# Altium schematic sheet Rpi.SchDoc
size A
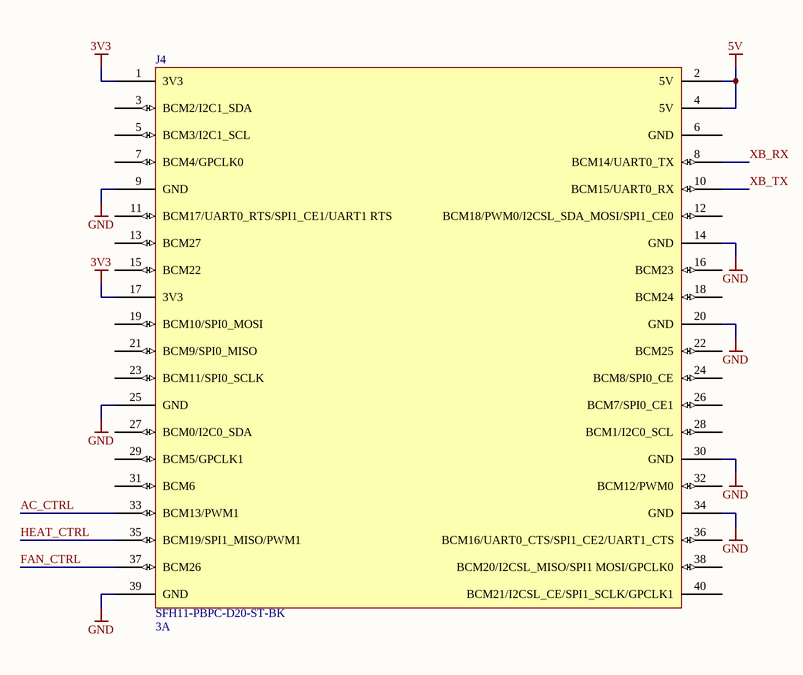
[diagram p0: Rpi.SchDoc]

## Parts
J4  Rating: 3A  [SFH11-PBPC-D20-ST-BK]  (hidden comment: J_RPI2B_ SFH11-PBPC-D20-ST-BK)

## Nets
3V3: J4.1(3V3) J4.17(3V3)
5V: J4.2(5V) J4.4(5V)
GND: J4.9(GND) J4.14(GND) J4.20(GND) J4.25(GND) J4.30(GND) J4.34(GND) J4.39(GND)
AC_CTRL: J4.33(BCM13/PWM1)
FAN_CTRL: J4.37(BCM26)
HEAT_CTRL: J4.35(BCM19/SPI1_MISO/PWM1)
XB_RX: J4.8(BCM14/UART0_TX)
XB_TX: J4.10(BCM15/UART0_RX)

Not connected (* = marked no-connect by the designer): J4 3(BCM2/I2C1_SDA) 5(BCM3/I2C1_SCL) 6(GND) 7(BCM4/GPCLK0) 11(BCM17/UART0_RTS/SPI1_CE1/UART1_RTS) 12(BCM18/PWM0/I2CSL_SDA_MOSI/SPI1_CE0) 13(BCM27) 15(BCM22) 16(BCM23) 18(BCM24) 19(BCM10/SPI0_MOSI) 21(BCM9/SPI0_MISO) 22(BCM25) 23(BCM11/SPI0_SCLK) 24(BCM8/SPI0_CE) 26(BCM7/SPI0_CE1) 27(BCM0/I2C0_SDA) 28(BCM1/I2C0_SCL) 29(BCM5/GPCLK1) 31(BCM6) 32(BCM12/PWM0) 36(BCM16/UART0_CTS/SPI1_CE2/UART1_CTS) 38(BCM20/I2CSL_MISO/SPI1_MOSI/GPCLK0) 40(BCM21/I2CSL_CE/SPI1_SCLK/GPCLK1)

## Library data of the parts
J4 = J_RPI2B_ SFH11-PBPC-D20-ST-BK: Manufacturer: Sullins Connector Solutions; PartNumber: SFH11-PBPC-D20-ST-BK